# Altium schematic sheet Sheet1.SchDoc
size A
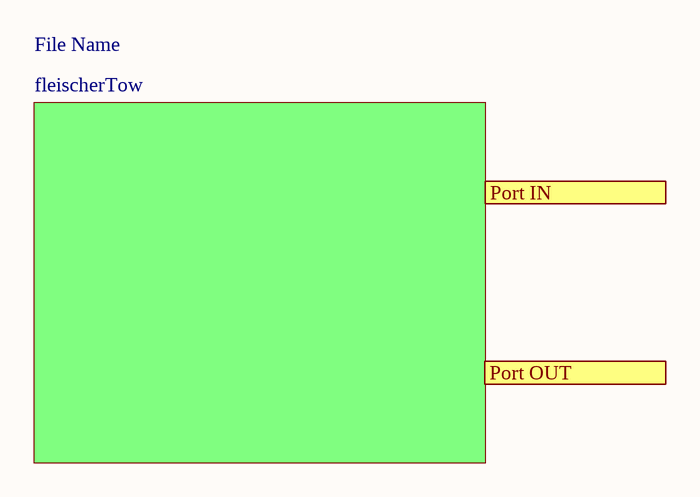
[diagram p0: Sheet1.SchDoc]

## Sub-sheets
fleischerTow = File Name: no entries

## Ports
Port IN (in), Port OUT (out)